# Altium schematic sheet Test Gate.SchDoc
size A3; SheetNumber: 1; SheetTotal: 1
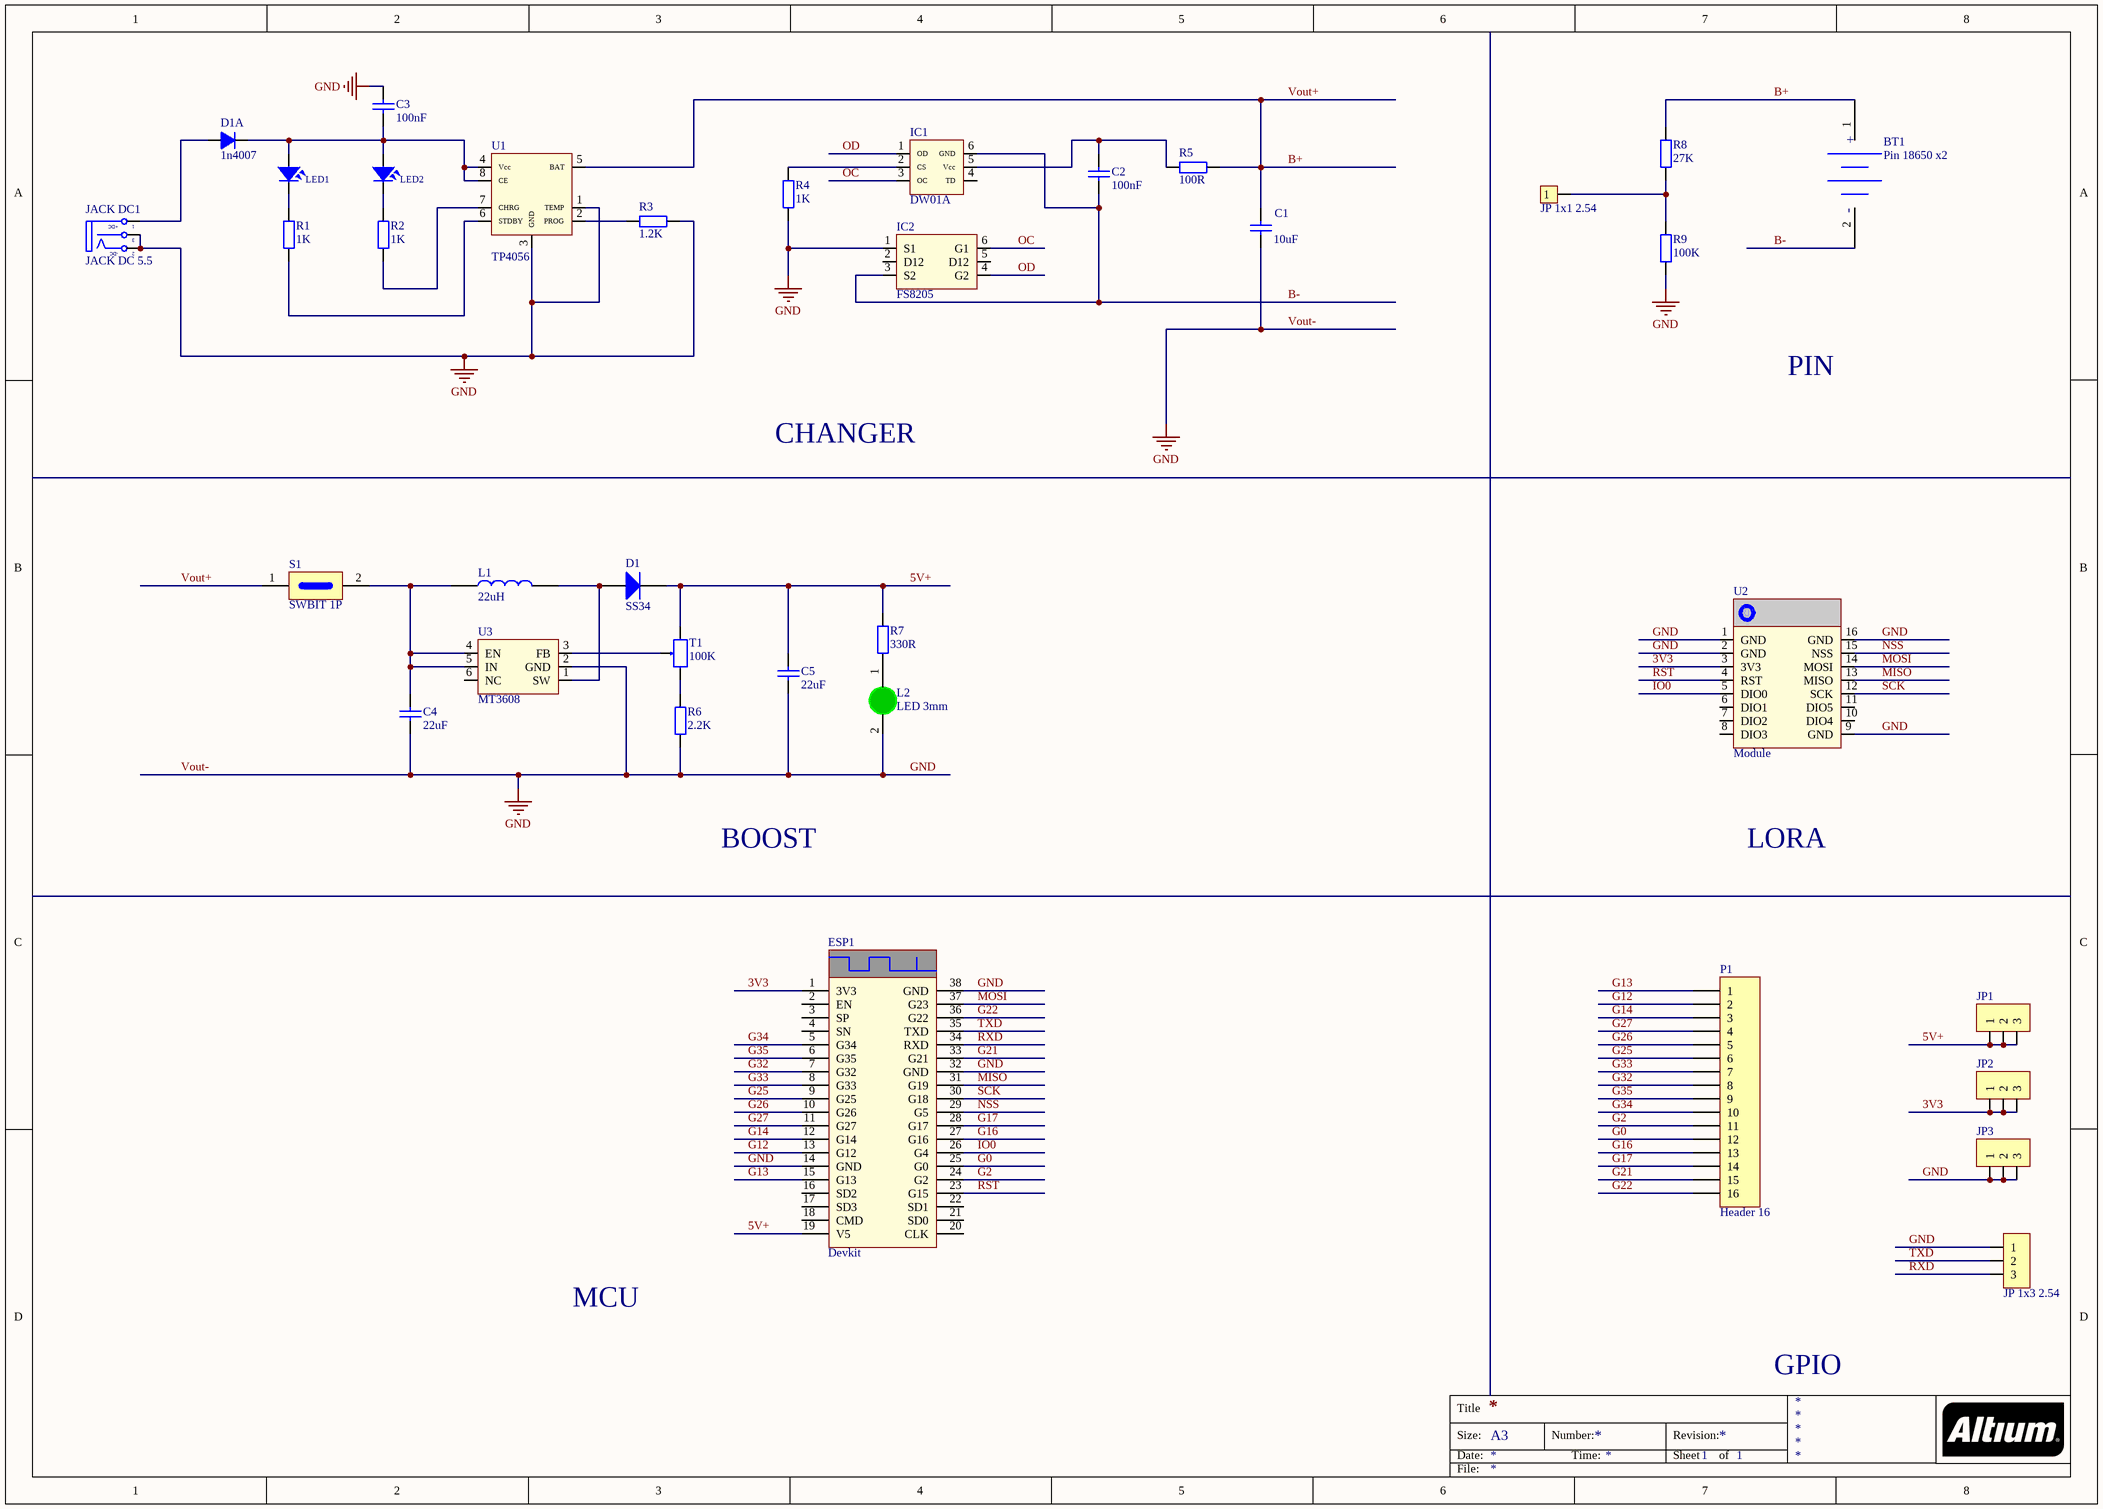
[diagram p0: Test Gate.SchDoc]

## Parts
BT1  Pin 18650 x2  [De Pin 18650 x2]
C1  10uF  [tu 0805]
C2  100nF  [tu 0805]
C3  100nF  [tu 0805]
C4  22uF  [tu 1206]
C5  22uF  [tu 1206]
D1  SS34  [DIODE SMA]
D1A  1n4007  [DIODE 1A]
ESP1  Devkit  [ESP32 DEVKIT 38Pin]
IC1  DW01A  [DW01A]
IC2  FS8205  [FS8205]
JACK_DC1  JACK DC 5.5  [JACK DC 5.5]
JP1  JP 1x3 2.54  [JP 1x3 CT]  (value not drawn)
JP2  JP 1x3 2.54  [JP 1x3 CT]  (value not drawn)
JP3  JP 1x3 2.54  [JP 1x3 CT]  (value not drawn)
JP4  JP 1x1 2.54  [JP 1x1 DT]
JP5  JP 1x3 2.54  [JP 1x3 CT]
L1  22uH  [Cuon Cam 7x7x5]
L2  LED 3mm  [LED-3MM-GREEN]
LED1  LED SMD  [SM-LED-0805-Red]  (value not drawn)
LED2  LED SMD  [SM-LED-0805-Red]  (value not drawn)
P1  Header 16  [HDR1X16]
R1  1K  [tro smd 0805]
R2  1K  [tro smd 0805]
R3  1.2K  [tro smd 0805]
R4  1K  [tro smd 0805]
R5  100R  [tro smd 0805]
R6  2.2K  [tro smd 0805]
R7  330R  [tro smd 0805]
R8  27K  [tro smd 0805]
R9  100K  [tro smd 0805]
S1  SWBIT 1P  [SWBIT 1P DIP]
T1  100K  [Bien Tro Vi Chinh Dung]
U1  TP4056  [TP4056]
U2  Module  [LoRa Ra 02 Module 2]
U3  MT3608  [MT3608]

## Nets
GND: C1.2 C3.1 C4.2 C5.2 ESP1.14(GND) ESP1.32(GND) ESP1.38(GND) IC2.1(S1) JACK_DC1.2(TN) JACK_DC1.3(S) JP3.1 JP3.2 JP3.3 JP5.1 L2.2(K) R3.2 R4.2 R6.2 R9.2 U1.1(TEMP) U1.3(GND) U2.1(GND) U2.2(GND) U2.9(GND) U2.16(GND) U3.2(GND)  [also labelled Vout-]
3V3: ESP1.1(3V3) JP2.1 JP2.2 JP2.3 U2.3(3V3)
5V+: C5.1 D1.2(K) ESP1.19(V5) JP1.1 JP1.2 JP1.3 R7.1 T1.3
B+: BT1.1(+) C1.1 R5.2 R8.1 S1.1 U1.5(BAT)  [also labelled Vout+]
B-: BT1.2(-) C2.2 IC1.6(GND) IC2.3(S2)
G0: ESP1.25(G0) P1.12
G2: ESP1.24(G2) P1.11
G12: ESP1.13(G12) P1.2
G13: ESP1.15(G13) P1.1
G14: ESP1.12(G14) P1.3
G16: ESP1.27(G16) P1.13
G17: ESP1.28(G17) P1.14
G21: ESP1.33(G21) P1.15
G22: ESP1.36(G22) P1.16
G25: ESP1.9(G25) P1.6
G26: ESP1.10(G26) P1.5
G27: ESP1.11(G27) P1.4
G32: ESP1.7(G32) P1.8
G33: ESP1.8(G33) P1.7
G34: ESP1.5(G34) P1.10
G35: ESP1.6(G35) P1.9
IO0: ESP1.26(G4) U2.5(DIO0)
MISO: ESP1.31(G19) U2.13(MISO)
MOSI: ESP1.37(G23) U2.14(MOSI)
NSS: ESP1.29(G5) U2.15(NSS)
OC: IC1.3(OC) IC2.6(G1)
OD: IC1.1(OD) IC2.4(G2)
RST: ESP1.23(G15) U2.4(RST)
RXD: ESP1.34(RXD) JP5.3
SCK: ESP1.30(G18) U2.12(SCK)
TXD: ESP1.35(TXD) JP5.2
NetC2_1: C2.1 IC1.5(Vcc) R5.1
NetC3_2: C3.2 D1A.2(K) LED1.1 LED2.1 U1.4(Vcc) U1.8(CE)
NetC4_1: C4.1 L1.1 S1.2 U3.4(EN) U3.5(IN)
NetD1_1: D1.1(A) L1.2 U3.1(SW)
NetD1A_1: D1A.1(A) JACK_DC1.1(T)
NetIC1_2: IC1.2(CS) R4.1
NetJP4_1: JP4.1 R8.2 R9.1
NetL2_1: L2.1(A) R7.2
NetLED1_2: LED1.2 R1.1
NetLED2_2: LED2.2 R2.1
NetR1_2: R1.2 U1.6(STDBY)
NetR2_2: R2.2 U1.7(CHRG)
NetR3_1: R3.1 U1.2(PROG)
NetR6_1: R6.1 T1.1
NetT1_2: T1.2 U3.3(FB)

Not connected (* = marked no-connect by the designer): ESP1 2(EN) 3(SP) 4(SN) 16(SD2) 17(SD3) 18(CMD) 20(CLK) 21(SD0) 22(SD1); IC1 4(TD); IC2 2(D12) 5(D12); U2 6(DIO1) 7(DIO2) 8(DIO3) 10(DIO4) 11(DIO5); U3 6(NC)

## Notes on the sheet
- PIN
- CHANGER
- BOOST
- LORA
- MCU
- GPIO
- Title
- Size:
- Date:
- A3
- Number:
- Time:
- Revision:
- Sheet
- of
- File:
- (in symbol JACK DC 5.5) +DC; -DC

## Library data of the parts
BT1 = De Pin 18650 x2
C1-C3 = Tu 0805 104 50V 10%: Dán; Don_Vi: Con; So_Chan: 2; Ten_Linh_Kien: Tụ 0805 104-100nF 10% 50V; Ma_Hang: MH004551; Chung_Loai: Dán; Kieu_Chan: *
C4 C5 = Tu 1206 226 16V 20%: Dán; Don_Vi: Con; So_Chan: 2; Ten_Linh_Kien: Tụ 1206 226-22uF 20% 16V; Ma_Hang: MH004546; Chung_Loai: Dán; Kieu_Chan: *
D1 = Diode SS34 ( 1N5822 ): Dán; Don_Vi: Con; Ma_Hang: MH002104; Ten_Linh_Kien: Diode SS34 3A 40V SMA ( 1N5822 SS34A); Kieu_Chan: *; Chung_Loai: Dán
D1A = Diode 1N4007: Cắm; Ten_Linh_Kien: Diode 1N4007 1A (DIP); Don_Vi: Con; Ma_Hang: MH001063; Ghi Chu: *; Kieu_Chan: *; Chung_Loai: Cắm
ESP1 = ESP32 DEV KIT: Board
IC2 = FS8205: SOT23-6
JACK_DC1 = JACK DC 5.5: Value: Jac DC
JP1-JP3 JP5 = JP 1x3 2.54 Cai Thang: Cắm; Ten_Linh_Kien: Jump Đơn Cái 2.54MM 1x20P Thẳng; Don_Vi: Con; Ma_Hang: MH004006; Ghi_Chu: *; Kieu_Chan: *; Chung_Loai: Cắm
JP4 = JP 1x1 2.54 Duc Thang: Cắm; Ten_Linh_Kien: Jump Đơn Đực 2.54MM 1x40P Thẳng 11MM; Don_Vi: Con; Ma_Hang: MH000903; Ghi_Chu: *; Kieu_Chan: *; Chung_Loai: Cắm
L1 = CUON CAM 47uH SMD: Dán; Don_Vi: Con; Ma_Hang: MH004211; Ten_Linh_Kien: Cuộn Cảm 47uH 7x7x4MM CD74R; Ghi_Chu: *; Kieu_Chan: *; Chung_Loai: Dán
L2 = LED 3mm Xanh La: Cắm; Don_Vi: Con; Ma_Hang: MH001054; Ten_Linh_Kien: Led 3MM Phủ Xanh (10c); Ghi_Chu: *; Kieu_Chan: *; Chung_Loai: Cắm
LED1 LED2 = LED SMD 0805
P1 = Header 16: Header, 16-Pin; LatestRevisionDate: 17-Jul-2002; LatestRevisionNote: Re-released for DXP Platform.; Publisher: Altium Limited
R1-R9 = Tro 0805 5% 1k: Dán; Don_Vi: Con; So_Chan: 2; Ten_Linh_Kien: Trở 0805 5% 1k; Ma_Hang: MH005234; Chung_Loai: Dán; Kieu_Chan: *
T1 = Bien Tro Tinh Chinh 10K Dung: Cắm; Ma_Hang: MH003232; Ten_Linh_Kien: Biến Trở VR 103-10K 3296W; Don_Vi: Con; Kieu_Chan: *; Chung_Loai: Cắm; Ghi_Chu: *
U2 = LoRa Ra 02 Module 2
U3 = MT3608: SMD